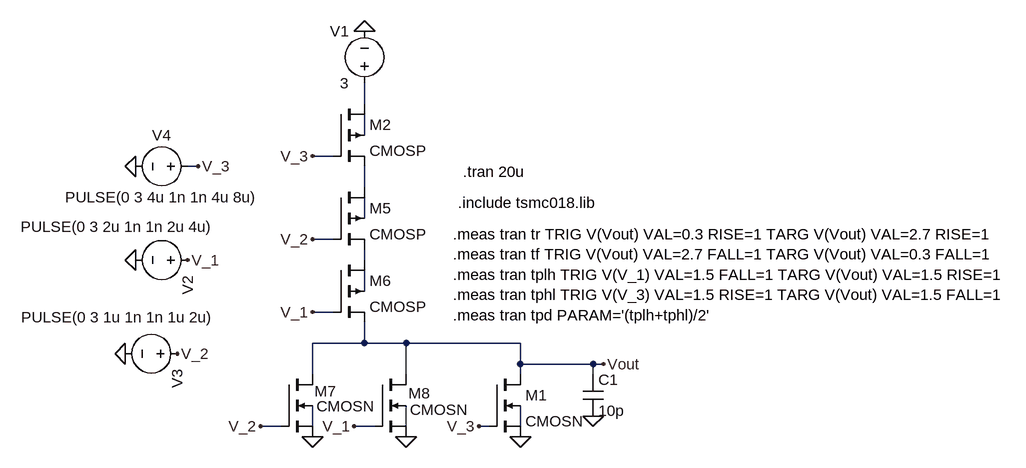
[diagram p0: schematic NOR.asc]
NOR.asc, the LTspice schematic file:
Version 4
SHEET 1 1492 680
WIRE 256 -96 256 -128
WIRE 256 -48 256 -80
WIRE 208 -16 176 -16
WIRE 0 0 -16 0
WIRE 256 32 256 0
WIRE 256 80 256 48
WIRE 208 112 176 112
WIRE 256 144 256 128
WIRE 256 192 256 160
WIRE 208 224 176 224
WIRE 256 272 256 240
WIRE 256 272 176 272
WIRE 320 272 256 272
WIRE 496 272 320 272
WIRE 496 304 496 272
WIRE 608 304 496 304
WIRE 624 304 608 304
WIRE 176 320 176 272
WIRE 320 320 320 272
WIRE 496 320 496 304
WIRE 608 320 608 304
WIRE 128 400 96 400
WIRE 176 400 176 368
WIRE 272 400 240 400
WIRE 320 400 320 368
WIRE 448 400 432 400
WIRE 496 400 496 368
FLAG 176 416 0
FLAG 320 416 0
FLAG 256 -208 0
FLAG 176 112 V_2
FLAG 96 400 V_2
FLAG 176 224 V_1
FLAG 240 400 V_1
FLAG 624 304 Vout
FLAG -96 144 0
FLAG -112 288 0
FLAG -32 288 V_2
FLAG -16 144 V_1
FLAG 496 416 0
FLAG 432 400 V_3
FLAG 176 -16 V_3
FLAG -96 0 0
FLAG 0 0 V_3
FLAG 608 384 0
SYMBOL voltage 256 -112 R180
WINDOW 0 24 96 Left 2
WINDOW 3 24 16 Left 2
WINDOW 123 0 0 Left 0
WINDOW 39 0 0 Left 0
SYMATTR InstName V1
SYMATTR Value 3
SYMBOL voltage 0 144 R90
WINDOW 123 0 0 Left 0
WINDOW 39 0 0 Left 0
WINDOW 3 -51 -24 VRight 2
SYMATTR Value PULSE(0 3 2u 1n 1n 2u 4u)
SYMATTR InstName V2
SYMBOL voltage -16 288 R90
WINDOW 123 0 0 Left 0
WINDOW 39 0 0 Left 0
WINDOW 3 -56 -41 VRight 2
SYMATTR Value PULSE(0 3 1u 1n 1n 1u 2u)
SYMATTR InstName V3
SYMBOL pmos4 208 32 R0
SYMATTR InstName M5
SYMATTR Value2 l=0.18u w=1.5u
SYMATTR Value CMOSP
SYMBOL pmos4 208 144 R0
SYMATTR InstName M6
SYMATTR Value2 l=0.18u w=1.5u
SYMATTR Value CMOSP
SYMBOL nmos4 128 320 R0
WINDOW 0 51 26 Left 2
WINDOW 3 54 49 Left 2
SYMATTR InstName M7
SYMATTR Value CMOSN
SYMATTR Value2 l=0.18u w=3u
SYMBOL nmos4 272 320 R0
WINDOW 0 52 29 Left 2
WINDOW 3 54 54 Left 2
SYMATTR InstName M8
SYMATTR Value CMOSN
SYMATTR Value2 l=0.18u w=3u
SYMBOL nmos4 448 320 R0
SYMATTR InstName M1
SYMATTR Value CMOSN
SYMATTR Value2 l=0.18u w=3u
SYMBOL pmos4 208 -96 R0
SYMATTR InstName M2
SYMATTR Value2 l=0.18u w=1.5u
SYMATTR Value CMOSP
SYMBOL voltage 0 0 R90
WINDOW 0 -32 56 VBottom 2
WINDOW 3 32 56 VTop 2
SYMATTR InstName V4
SYMATTR Value PULSE(0 3 4u 1n 1n 4u 8u)
SYMBOL cap 592 320 R0
SYMATTR InstName C1
SYMATTR Value 10p
TEXT 392 104 Left 2 !.meas tran tr TRIG V(Vout) VAL=0.3 RISE=1 TARG V(Vout) VAL=2.7 RISE=1\n.meas tran tf TRIG V(Vout) VAL=2.7 FALL=1 TARG V(Vout) VAL=0.3 FALL=1\n.meas tran tplh TRIG V(V_1) VAL=1.5 FALL=1 TARG V(Vout) VAL=1.5 RISE=1\n.meas tran tphl TRIG V(V_3) VAL=1.5 RISE=1 TARG V(Vout) VAL=1.5 FALL=1\n.meas tran tpd PARAM='(tplh+tphl)/2'
TEXT 408 8 Left 2 !.tran 20u
TEXT 400 56 Left 2 !.include tsmc018.lib

The netlist it stands for:
* NOR.asc
V1 N001 0 3
V2 V_1 0 PULSE(0 3 2u 1n 1n 2u 4u)
V3 V_2 0 PULSE(0 3 1u 1n 1n 1u 2u)
M5 N003 V_2 N005 N004 CMOSP l=0.18u w=1.5u
M6 N005 V_1 Vout N006 CMOSP l=0.18u w=1.5u
M7 Vout V_2 0 N007 CMOSN l=0.18u w=3u
M8 Vout V_1 0 N008 CMOSN l=0.18u w=3u
M1 Vout V_3 0 N009 CMOSN l=0.18u w=3u
M2 N001 V_3 N003 N002 CMOSP l=0.18u w=1.5u
V4 V_3 0 PULSE(0 3 4u 1n 1n 4u 8u)
C1 Vout 0 10p
.model NMOS NMOS
.model PMOS PMOS
.lib standard.mos
.meas tran tr TRIG V(Vout) VAL=0.3 RISE=1 TARG V(Vout) VAL=2.7 RISE=1
.meas tran tf TRIG V(Vout) VAL=2.7 FALL=1 TARG V(Vout) VAL=0.3 FALL=1
.meas tran tplh TRIG V(V_1) VAL=1.5 FALL=1 TARG V(Vout) VAL=1.5 RISE=1
.meas tran tphl TRIG V(V_3) VAL=1.5 RISE=1 TARG V(Vout) VAL=1.5 FALL=1
.meas tran tpd PARAM='(tplh+tphl)/2'
.tran 20u
.include tsmc018.lib
.backanno
.end